# Altium schematic sheet Sheet1.SchDoc
size A4
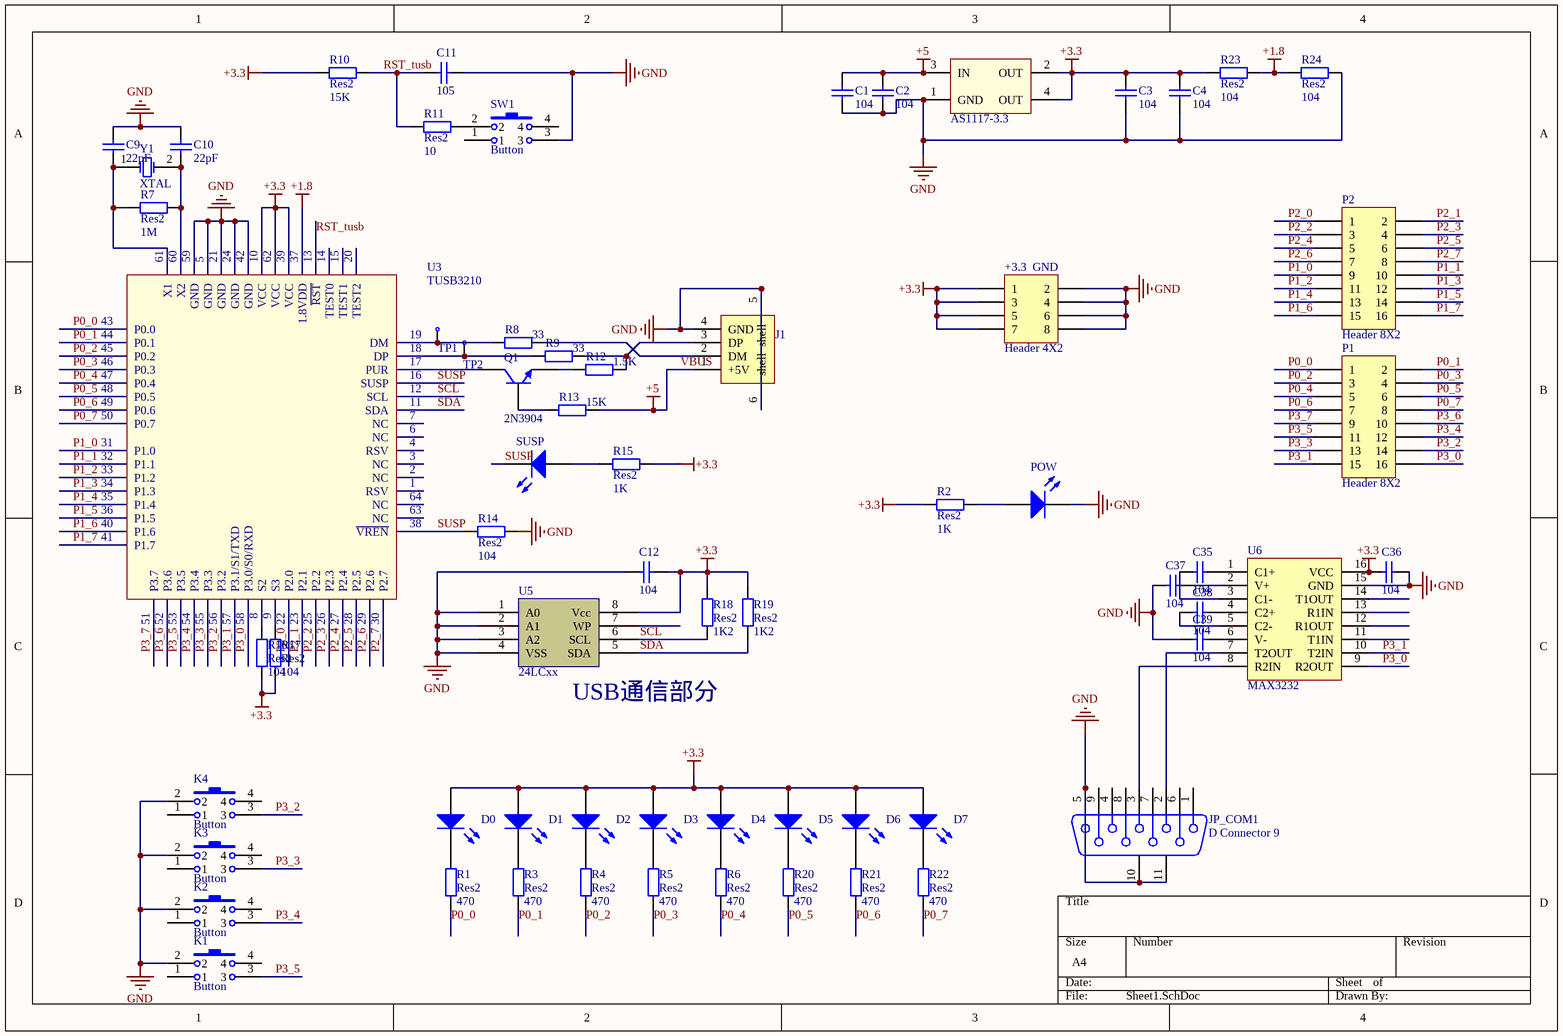
[diagram p0: Sheet1.SchDoc]

## Parts
+3.3_GND  Header 4X2  [HDR2X4]
AS1117-3.3  AS1117-3.3  [DSO-G3]  (value not drawn)
C1  value 104  [C0805]  (hidden comment: Cap)
C2  value 104  [C0805]  (hidden comment: Cap)
C3  value 104  [C0805]  (hidden comment: Cap)
C4  value 104  [C0805]  (hidden comment: Cap)
C9  value 22pF  [C0805]  (hidden comment: Cap)
C10  value 22pF  [C0805]  (hidden comment: Cap)
C11  value 105  [C0805]  (hidden comment: Cap)
C12  value 104  [C0805]  (hidden comment: Cap)
C35  value 104  [C0805]  (hidden comment: Cap)
C36  value 104  [C0805]  (hidden comment: Cap)
C37  value 104  [C0805]  (hidden comment: Cap)
C38  value 104  [C0805]  (hidden comment: Cap)
C39  value 104  [C0805]  (hidden comment: Cap)
D0  LED1  [LED]  (value not drawn)
D1  LED1  [LED]  (value not drawn)
D2  LED1  [LED]  (value not drawn)
D3  LED1  [LED]  (value not drawn)
D4  LED1  [LED]  (value not drawn)
D5  LED1  [LED]  (value not drawn)
D6  LED1  [LED]  (value not drawn)
D7  LED1  [LED]  (value not drawn)
J1  USB_A  [USB-A]  (value not drawn)
JP_COM1  D Connector 9  [DSUB1.385-2H9]
K1  Button  [SW-6]
K2  Button  [SW-6]
K3  Button  [SW-6]
K4  Button  [SW-6]
P1  Header 8X2  [HDR2X8]
P2  Header 8X2  [HDR2X8]
POW  LED1  [LED]  (value not drawn)
Q1  2N3904  [TO-92A]
R1  Res2  value 470  [c0805]
R2  Res2  value 1K  [c0805]
R3  Res2  value 470  [c0805]
R4  Res2  value 470  [c0805]
R5  Res2  value 470  [c0805]
R6  Res2  value 470  [c0805]
R7  Res2  value 1M  [c0805]
R8  value 33  [c0805]  (hidden comment: Res2)
R9  value 33  [c0805]  (hidden comment: Res2)
R10  Res2  value 15K  [c0805]
R11  Res2  value 10  [c0805]
R12  value 1.5K  [c0805]  (hidden comment: Res2)
R13  value 15K  [c0805]  (hidden comment: Res2)
R14  Res2  value 104  [c0805]
R15  Res2  value 1K  [c0805]
R16  Res2  value 104  [c0805]
R17  Res2  value 104  [c0805]
R18  Res2  value 1K2  [c0805]
R19  Res2  value 1K2  [c0805]
R20  Res2  value 470  [c0805]
R21  Res2  value 470  [c0805]
R22  Res2  value 470  [c0805]
R23  Res2  value 104  [c0805]
R24  Res2  value 104  [c0805]
SUSP  LED1  [LED]  (value not drawn)
SW1  Button  [SW-6]
TP1  TestPoint  [TESTPOINT]  (value not drawn)
TP2  TestPoint  [TESTPOINT]  (value not drawn)
U3  TUSB3210  [Quad64]
U5  24LCxx  [DIP-8]
U6  MAX3232  [SOP16]
Y1  XTAL  [GJA-M]

## Nets
+1.8: R23.1 R24.2 U3.37(1.8VDD)
+3.3: +3.3_GND.1 +3.3_GND.3 +3.3_GND.5 +3.3_GND.7 AS1117-3.3.2(OUT) AS1117-3.3.4(OUT) C3.2 C4.2 C12.2 C36.1 D0.1(A) D1.1(A) D2.1(A) D3.1(A) D4.1(A) D5.1(A) D6.1(A) D7.1(A) R2.1 R10.2 R15.1 R16.1 R17.1 R18.2 R19.2 R23.2 U3.10(VCC) U3.39(VCC) U3.62(VCC) U5.8(Vcc) U6.16(VCC)
GND: +3.3_GND.2 +3.3_GND.4 +3.3_GND.6 +3.3_GND.8 AS1117-3.3.1(GND) C1.1 C2.1 C3.1 C4.1 C9.2 C10.2 C11.2 C12.1 C36.2 C37.1 C39.1 J1.4(GND) J1.5(shell) J1.6(shell) JP_COM1.5 JP_COM1.10(MH1) JP_COM1.11(MH2) K1.2 K2.2 K3.2 K4.2 POW.2(K) R14.2 R24.1 SW1.3 U3.5(GND) U3.21(GND) U3.24(GND) U3.42(GND) U3.59(GND) U5.1(A0) U5.2(A1) U5.3(A2) U5.4(VSS) U6.15(GND)
VBUS: AS1117-3.3.3(IN) C1.2 C2.2 J1.1(+5V) R13.2  [also labelled +5]
P0_0: P1.1 R1.1 U3.43(P0.0)
P0_1: P1.2 R3.1 U3.44(P0.1)
P0_2: P1.3 R4.1 U3.45(P0.2)
P0_3: P1.4 R5.1 U3.46(P0.3)
P0_4: P1.5 R6.1 U3.47(P0.4)
P0_5: P1.6 R20.1 U3.48(P0.5)
P0_6: P1.7 R21.1 U3.49(P0.6)
P0_7: P1.8 R22.1 U3.50(P0.7)
P1_0: P2.9 U3.31(P1.0)
P1_1: P2.10 U3.32(P1.1)
P1_2: P2.11 U3.33(P1.2)
P1_3: P2.12 U3.34(P1.3)
P1_4: P2.13 U3.35(P1.4)
P1_5: P2.14 U3.36(P1.5)
P1_6: P2.15 U3.40(P1.6)
P1_7: P2.16 U3.41(P1.7)
P2_0: P2.1 U3.22(P2.0)
P2_1: P2.2 U3.23(P2.1)
P2_2: P2.3 U3.25(P2.2)
P2_3: P2.4 U3.26(P2.3)
P2_4: P2.5 U3.27(P2.4)
P2_5: P2.6 U3.28(P2.5)
P2_6: P2.7 U3.29(P2.6)
P2_7: P2.8 U3.30(P2.7)
P3_0: P1.16 U3.58(P3.0/S0/RXD) U6.9(R2OUT)
P3_1: P1.15 U3.57(P3.1/S1/TXD) U6.10(T2IN)
P3_2: K4.3 P1.14 U3.56(P3.2)
P3_3: K3.3 P1.13 U3.55(P3.3)
P3_4: K2.3 P1.12 U3.54(P3.4)
P3_5: K1.3 P1.11 U3.53(P3.5)
P3_6: P1.10 U3.52(P3.6)
P3_7: P1.9 U3.51(P3.7)
RST_tusb: C11.1 R10.1 R11.2 U3.13(~{RST})
SCL: R18.1 U3.12(SCL) U5.6(SCL)
SDA: R19.1 U3.11(SDA) U5.5(SDA)
SUSP: R14.1 SUSP.2(K) U3.16(SUSP) U3.38(~{VREN})
NetC9_1: C9.1 R7.1 U3.61(X1) Y1.1(OSC1)
NetC10_1: C10.1 R7.2 U3.60(X2) Y1.2(OSC2)
NetC35_1: C35.1 U6.1(C1+)
NetC35_2: C35.2 U6.3(C1-)
NetC37_2: C37.2 U6.2(V+)
NetC38_1: C38.1 U6.4(C2+)
NetC38_2: C38.2 U6.5(C2-)
NetC39_2: C39.2 U6.6(V-)
NetD0_2: D0.2(K) R1.2
NetD1_2: D1.2(K) R3.2
NetD2_2: D2.2(K) R4.2
NetD3_2: D3.2(K) R5.2
NetD4_2: D4.2(K) R6.2
NetD5_2: D5.2(K) R20.2
NetD6_2: D6.2(K) R21.2
NetD7_2: D7.2(K) R22.2
NetJ1_2: J1.2(DM) R8.1
NetJ1_3: J1.3(DP) R9.1 R12.2
NetJP_COM1_2: JP_COM1.2 U6.7(T2OUT)
NetJP_COM1_3: JP_COM1.3 U6.8(R2IN)
NetPOW_1: POW.1(A) R2.2
NetQ1_1: Q1.1(E) R12.1
NetQ1_2: Q1.2(B) R13.1
NetQ1_3: Q1.3(C) U3.17(PUR)
NetR8_2: R8.2 TP1.1(TP) U3.19(DM)
NetR9_2: R9.2 TP2.1(TP) U3.18(DP)
NetR11_1: R11.1 SW1.2
NetR15_2: R15.2 SUSP.1(A)
NetR16_2: R16.2 U3.8(S2)
NetR17_2: R17.2 U3.9(S3)

Not connected (* = marked no-connect by the designer): JP_COM1 1 4 6 7 8 9; K1 1 4; K2 1 4; K3 1 4; K4 1 4; SW1 1 4; U3 1(RSV) 2(NC) 3(NC) 4(RSV) 6(NC) 7(NC) 14(TEST0) 15(TEST1) 20(TEST2) 63(NC) 64(NC); U5 7(WP); U6 11(T1IN) 12(R1OUT) 13(R1IN) 14(T1OUT)

## Notes on the sheet
- (near U5) USB通信部分

## Library data of the parts
+3.3_GND = Header 4X2: Header, 4-Pin, Dual row; LatestRevisionDate: 17-Jul-2002; LatestRevisionNote: Re-released for DXP Platform.; Publisher: Altium Limited
C1-C4 C9-C12 C35-C39 = Cap: Capacitor; Published: 8-Jun-2000; Revision: July-2002: Re-released for DXP Platform.; Publisher: Altium Limited
D0-D7 POW SUSP = LED1: Typical RED GaAs LED; Published: 8-Jun-2000; LatestRevisionDate: 08-Jul-2005; LatestRevisionNote: Mech Layer 1 removed.; PackageReference: LED-1; Publisher: Altium Limited
JP_COM1 = D Connector 9: Receptacle Assembly, 9 Position, Right Angle; PackageDocument: O; Positions: 9; Published: 15-Jun-2001; LatestRevisionDate: 17-Jul-2002; LatestRevisionNote: Re-released for DXP Platform.; DatasheetDocument: 1-Sep-1999; PackageReference: 788750; Publisher: Altium Limited; Orientation: Right Angle; Gender: Receptacle
K1-K4 SW1 = Button_4
P1 P2 = Header 8X2: Header, 8-Pin, Dual row; LatestRevisionDate: 17-Jul-2002; LatestRevisionNote: Re-released for DXP Platform.; Publisher: Altium Limited
Q1 = 2N3904: NPN General Purpose Amplifier; Published: 8-Jun-2000; LatestRevisionDate: 15-Jan-2003; LatestRevisionNote: PCB Footprint 'BCY-W3/D4.7' replaced; DatasheetDocument: 1997; PackageDocument: Sep-1998; PackageReference: TO-92A; Publisher: Altium Limited; Code_JEDEC: TO-92A; ComponentLink1Description: Manufacturer Link; ComponentLink1URL: http://www.fairchildsemi.com/; ComponentLink2Description: Datasheet; ComponentLink2URL: http://www.fairchildsemi.com/ds/2N%2F2N3904.pdf
R1-R24 = Res2: Resistor; Published: 8-Jun-2000; Revision: July-2002: Re-released for DXP Platform.; Publisher: Altium Limited
TP1 TP2 = TestPoint: TespPoint
Y1 = XTAL: Crystal Oscillator; Published: 8-Jun-2000; Revision: July-2002: Re-released for DXP Platform.; Publisher: Altium Limited